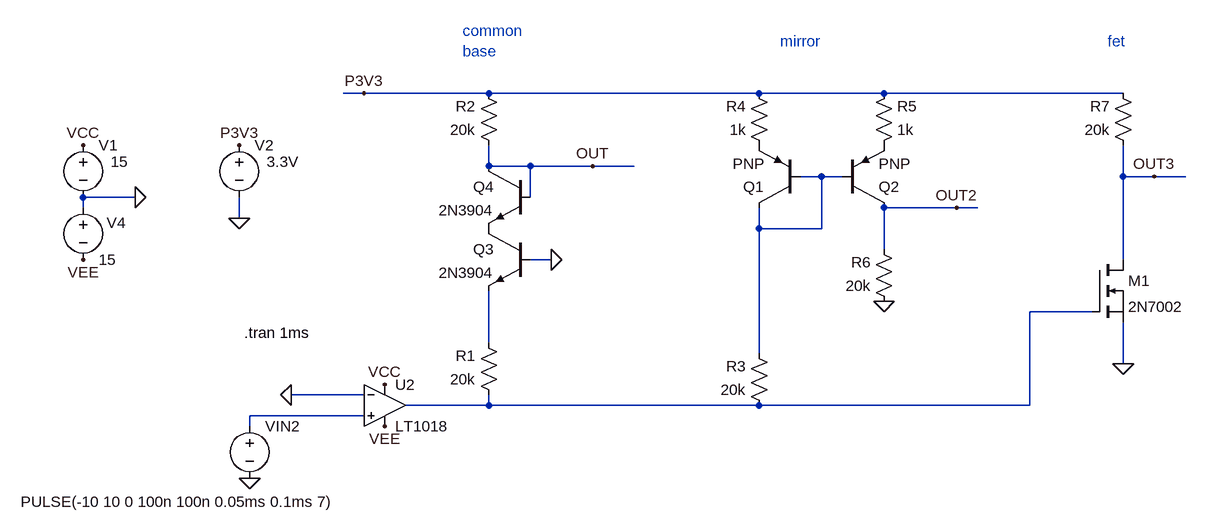
[diagram p0: schematic Draft03.asc]
Draft03.asc, the LTspice schematic file:
Version 4
SHEET 1 2756 2104
WIRE 0 -656 -32 -656
WIRE 192 -656 0 -656
WIRE 608 -656 192 -656
WIRE 800 -656 608 -656
WIRE 1168 -656 800 -656
WIRE 192 -544 192 -576
WIRE 256 -544 192 -544
WIRE 352 -544 256 -544
WIRE 416 -544 352 -544
WIRE 704 -528 672 -528
WIRE 736 -528 704 -528
WIRE 1168 -528 1168 -576
WIRE 1216 -528 1168 -528
WIRE 1264 -528 1216 -528
WIRE -352 -496 -432 -496
WIRE 256 -496 256 -544
WIRE -432 -480 -432 -496
WIRE 912 -480 800 -480
WIRE 944 -480 912 -480
WIRE -192 -464 -192 -496
WIRE 608 -448 608 -480
WIRE 704 -448 704 -528
WIRE 704 -448 608 -448
WIRE 800 -416 800 -480
WIRE 288 -400 256 -400
WIRE 1168 -400 1168 -528
WIRE 1120 -320 1024 -320
WIRE 192 -272 192 -352
WIRE 608 -256 608 -448
WIRE 1168 -240 1168 -304
WIRE 0 -192 -112 -192
WIRE 192 -176 192 -192
WIRE 192 -176 64 -176
WIRE 608 -176 192 -176
WIRE 1024 -176 1024 -320
WIRE 1024 -176 608 -176
WIRE 0 -160 -176 -160
WIRE -176 -144 -176 -160
FLAG -432 -576 VCC
FLAG -432 -400 VEE
FLAG -352 -496 0
FLAG 32 -208 VCC
FLAG 32 -144 VEE
FLAG -176 -64 0
FLAG -112 -192 0
FLAG 288 -400 0
FLAG -192 -576 P3V3
FLAG -192 -464 0
FLAG 0 -656 P3V3
FLAG 352 -544 OUT
FLAG 800 -336 0
FLAG 912 -480 OUT2
FLAG 1168 -240 0
FLAG 1216 -528 OUT3
SYMBOL voltage -432 -592 R0
WINDOW 123 0 0 Left 0
WINDOW 39 0 0 Left 0
WINDOW 3 42 41 Left 2
SYMATTR Value 15
SYMATTR InstName V1
SYMBOL voltage -432 -496 R0
WINDOW 123 0 0 Left 0
WINDOW 39 0 0 Left 0
WINDOW 0 36 39 Left 2
SYMATTR InstName V4
SYMATTR Value 15
SYMBOL res 208 -176 R180
WINDOW 0 36 76 Left 2
WINDOW 3 36 40 Left 2
SYMATTR InstName R1
SYMATTR Value 20k
SYMBOL Comparators\\LT1018 32 -176 R0
SYMATTR InstName U2
SYMBOL voltage -176 -160 R0
WINDOW 123 0 0 Left 0
WINDOW 39 0 0 Left 0
WINDOW 3 -352 132 Left 2
SYMATTR Value PULSE(-10 10 0 100n 100n 0.05ms 0.1ms 7)
SYMATTR InstName VIN2
SYMBOL npn 256 -448 M0
SYMATTR InstName Q3
SYMATTR Value 2N3904
SYMBOL res 208 -560 R180
WINDOW 0 36 76 Left 2
WINDOW 3 36 40 Left 2
SYMATTR InstName R2
SYMATTR Value 20k
SYMBOL voltage -192 -592 R0
WINDOW 123 0 0 Left 0
WINDOW 39 0 0 Left 0
WINDOW 3 42 41 Left 2
SYMATTR Value 3.3V
SYMATTR InstName V2
SYMBOL res 624 -160 R180
WINDOW 0 36 76 Left 2
WINDOW 3 36 40 Left 2
SYMATTR InstName R3
SYMATTR Value 20k
SYMBOL pnp 672 -480 R180
SYMATTR InstName Q1
SYMBOL res 624 -560 R180
WINDOW 0 36 76 Left 2
WINDOW 3 36 40 Left 2
SYMATTR InstName R4
SYMATTR Value 1k
SYMBOL pnp 736 -480 M180
SYMATTR InstName Q2
SYMBOL res 784 -560 M180
WINDOW 0 36 76 Left 2
WINDOW 3 36 40 Left 2
SYMATTR InstName R5
SYMATTR Value 1k
SYMBOL res 816 -320 R180
WINDOW 0 36 76 Left 2
WINDOW 3 36 40 Left 2
SYMATTR InstName R6
SYMATTR Value 20k
SYMBOL nmos 1120 -400 R0
SYMATTR InstName M1
SYMATTR Value 2N7002
SYMBOL res 1184 -560 R180
WINDOW 0 36 76 Left 2
WINDOW 3 36 40 Left 2
SYMATTR InstName R7
SYMATTR Value 20k
SYMBOL npn 256 -544 M0
SYMATTR InstName Q4
SYMATTR Value 2N3904
TEXT -184 -288 Left 2 !.tran 1ms
TEXT 152 -752 Left 2 ;common\nbase
TEXT 640 -736 Left 2 ;mirror
TEXT 1144 -736 Left 2 ;fet

The netlist it stands for:
* Draft03.asc
V1 VCC 0 15
V4 0 VEE 15
R1 N002 N003 20k
XU2 N004 0 VCC VEE N002 LT1018  ; pins In+ In- V+ V- OUT
VIN2 N004 0 PULSE(-10 10 0 100n 100n 0.05ms 0.1ms 7)
Q3 P001 0 N003 0 2N3904
R2 OUT P3V3 20k
V2 P3V3 0 3.3V
R3 N002 N001 20k
Q1 N001 N001 P002 0 PNP
R4 P002 P3V3 1k
Q2 OUT2 N001 P003 0 PNP
R5 P003 P3V3 1k
R6 0 OUT2 20k
M1 OUT3 N002 0 0 2N7002
R7 OUT3 P3V3 20k
Q4 OUT OUT P001 0 2N3904
.model NPN NPN
.model PNP PNP
.lib standard.bjt
.model NMOS NMOS
.model PMOS PMOS
.lib standard.mos
.tran 1ms
* common
* base
* mirror
* fet
.lib LTC1.lib
.backanno
.end